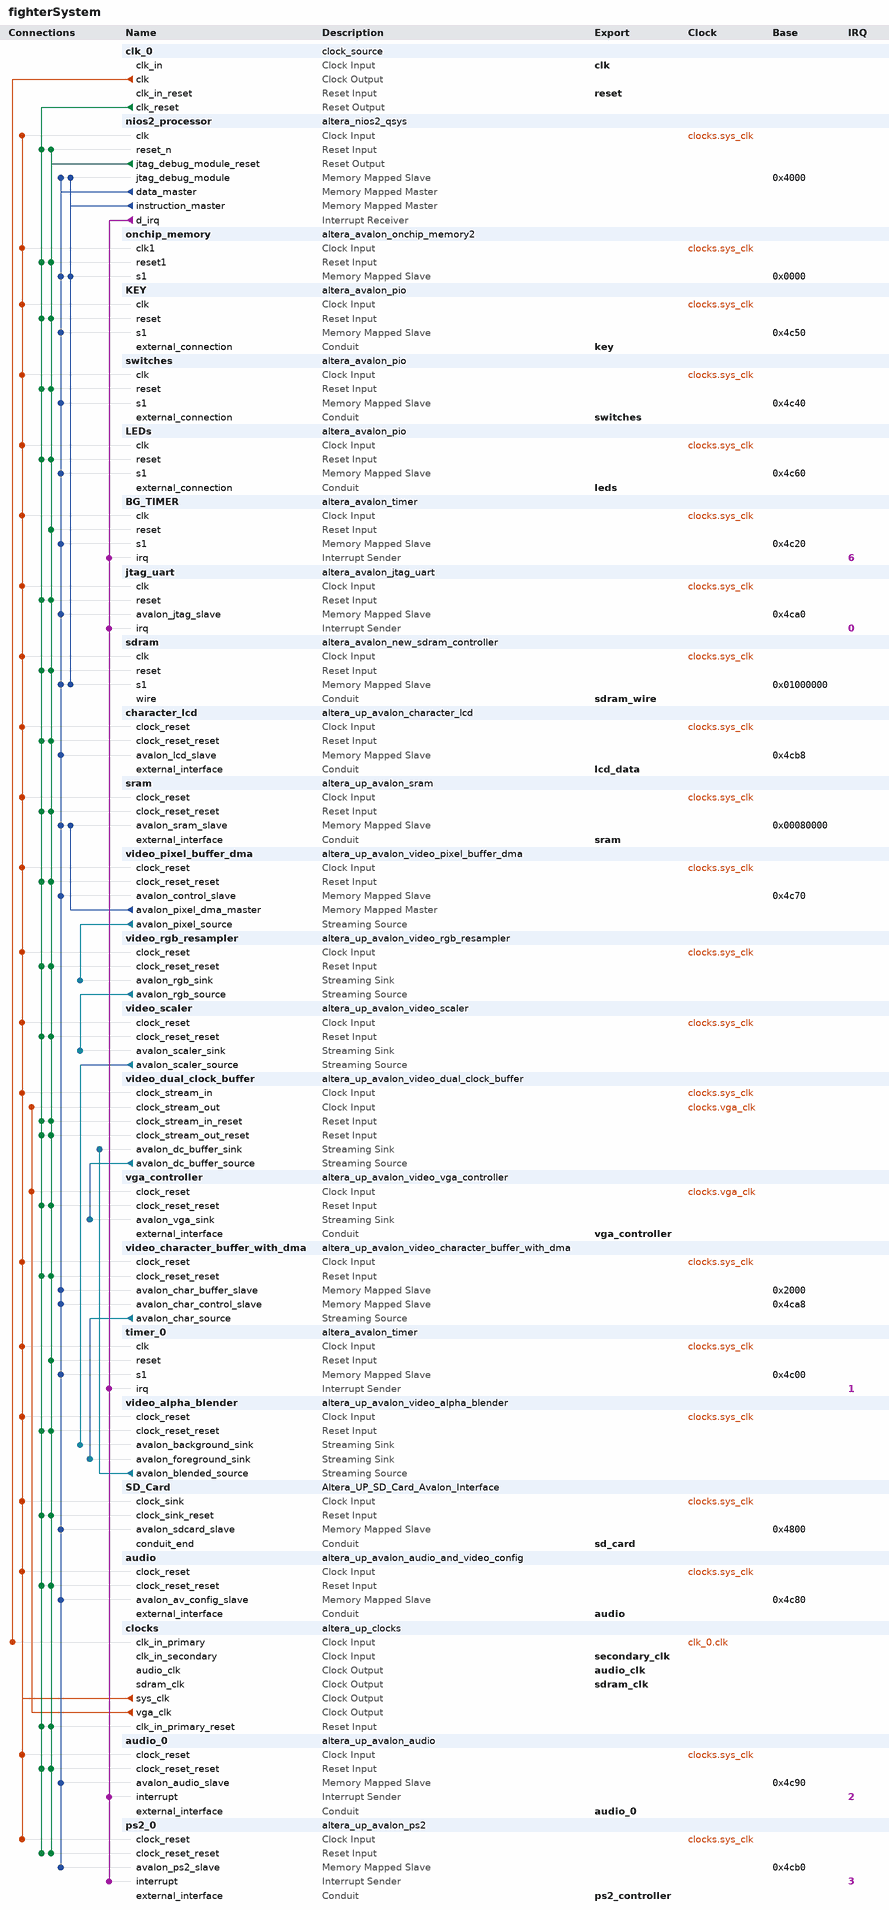
[diagram p0: system contents]
# Platform Designer (Qsys) system fighterSystem, Cyclone II EP2C35F672C6
# Parameters at their usual value, and those the tool derives, are not listed.
package require -exact qsys 12.0
create_system fighterSystem
set_project_property DEVICE_FAMILY {Cyclone II}
set_project_property DEVICE EP2C35F672C6

add_instance clk_0 clock_source 12.0
set_instance_parameter_value clk_0 clockFrequency 50000000

add_instance nios2_processor altera_nios2_qsys 12.0
set_instance_parameter_value nios2_processor resetSlave sdram.s1
set_instance_parameter_value nios2_processor exceptionSlave sdram.s1
set_instance_parameter_value nios2_processor breakSlave nios2_processor.jtag_debug_module
set_instance_parameter_value nios2_processor muldiv_multiplierType NoneSmall
set_instance_parameter_value nios2_processor impl Fast
set_instance_parameter_value nios2_processor icache_size 4096

add_instance onchip_memory altera_avalon_onchip_memory2 12.0
set_instance_parameter_value onchip_memory dataWidth 32
set_instance_parameter_value onchip_memory dualPort false
set_instance_parameter_value onchip_memory initMemContent true
set_instance_parameter_value onchip_memory initializationFileName onchip_memory
set_instance_parameter_value onchip_memory memorySize 4096

add_instance KEY altera_avalon_pio 12.0
set_instance_parameter_value KEY direction Input
set_instance_parameter_value KEY width 4

add_instance switches altera_avalon_pio 12.0
set_instance_parameter_value switches direction Input
set_instance_parameter_value switches width 8

add_instance LEDs altera_avalon_pio 12.0
set_instance_parameter_value LEDs direction Output
set_instance_parameter_value LEDs width 8

add_instance BG_TIMER altera_avalon_timer 12.0
set_instance_parameter_value BG_TIMER period 1
set_instance_parameter_value BG_TIMER periodUnits MSEC
set_instance_parameter_value BG_TIMER timerPreset CUSTOM

add_instance jtag_uart altera_avalon_jtag_uart 12.0
set_instance_parameter_value jtag_uart simInteractiveOptions INTERACTIVE_ASCII_OUTPUT

add_instance sdram altera_avalon_new_sdram_controller 12.0
set_instance_parameter_value sdram TAC 5.5
set_instance_parameter_value sdram TRCD 20.0
set_instance_parameter_value sdram TRP 20.0
set_instance_parameter_value sdram casLatency 3
set_instance_parameter_value sdram columnWidth 8
set_instance_parameter_value sdram dataWidth 16
set_instance_parameter_value sdram generateSimulationModel false
set_instance_parameter_value sdram model custom
set_instance_parameter_value sdram numberOfBanks 4
set_instance_parameter_value sdram numberOfChipSelects 1
set_instance_parameter_value sdram powerUpDelay 100.0
set_instance_parameter_value sdram refreshPeriod 15.625
set_instance_parameter_value sdram rowWidth 12

add_instance character_lcd altera_up_avalon_character_lcd 12.0
set_instance_parameter_value character_lcd cursor Normal

add_instance sram altera_up_avalon_sram 12.0
set_instance_parameter_value sram board DE2
set_instance_parameter_value sram pixel_buffer true

add_instance video_pixel_buffer_dma altera_up_avalon_video_pixel_buffer_dma 12.0
set_instance_parameter_value video_pixel_buffer_dma addr_mode Consecutive
set_instance_parameter_value video_pixel_buffer_dma start_address 0
set_instance_parameter_value video_pixel_buffer_dma back_start_address 0
set_instance_parameter_value video_pixel_buffer_dma image_width 320
set_instance_parameter_value video_pixel_buffer_dma image_height 240
set_instance_parameter_value video_pixel_buffer_dma color_space {16-bit RGB}

add_instance video_rgb_resampler altera_up_avalon_video_rgb_resampler 12.0
set_instance_parameter_value video_rgb_resampler input_type {16-bit RGB}
set_instance_parameter_value video_rgb_resampler output_type {30-bit RGB}
set_instance_parameter_value video_rgb_resampler alpha 1023

add_instance video_scaler altera_up_avalon_video_scaler 12.0
set_instance_parameter_value video_scaler width_scaling 2
set_instance_parameter_value video_scaler height_scaling 2
set_instance_parameter_value video_scaler width_in 320
set_instance_parameter_value video_scaler color_bits 10
set_instance_parameter_value video_scaler color_planes 3

add_instance video_dual_clock_buffer altera_up_avalon_video_dual_clock_buffer 12.0
set_instance_parameter_value video_dual_clock_buffer color_bits 10

add_instance vga_controller altera_up_avalon_video_vga_controller 12.0
set_instance_parameter_value vga_controller board DE2

add_instance video_character_buffer_with_dma altera_up_avalon_video_character_buffer_with_dma 12.0
set_instance_parameter_value video_character_buffer_with_dma enable_transparency true

add_instance timer_0 altera_avalon_timer 12.0
set_instance_parameter_value timer_0 period 1
set_instance_parameter_value timer_0 periodUnits MSEC
set_instance_parameter_value timer_0 timerPreset FULL_FEATURED

add_instance video_alpha_blender altera_up_avalon_video_alpha_blender 12.0

add_instance SD_Card Altera_UP_SD_Card_Avalon_Interface 1.0

add_instance audio altera_up_avalon_audio_and_video_config 12.0
set_instance_parameter_value audio board DE2
set_instance_parameter_value audio audio_in {Microphone to ADC}
set_instance_parameter_value audio line_in_bypass false
set_instance_parameter_value audio bit_length 16
set_instance_parameter_value audio sampling_rate {32 kHz}

add_instance clocks altera_up_clocks 12.0
set_instance_parameter_value clocks board DE2
set_instance_parameter_value clocks vga_clk true
set_instance_parameter_value clocks audio_clk true
set_instance_parameter_value clocks audio_clk_freq 12.288

add_instance audio_0 altera_up_avalon_audio 12.0
set_instance_parameter_value audio_0 avalon_bus_type {Memory Mapped}
set_instance_parameter_value audio_0 audio_in true
set_instance_parameter_value audio_0 dw 16

add_instance ps2_0 altera_up_avalon_ps2 12.0

# connections
add_connection clk_0.clk clocks.clk_in_primary clock
add_connection clocks.sys_clk audio.clock_reset clock
add_connection clocks.sys_clk audio_0.clock_reset clock
add_connection clocks.sys_clk BG_TIMER.clk clock
add_connection clocks.sys_clk character_lcd.clock_reset clock
add_connection clocks.sys_clk jtag_uart.clk clock
add_connection clocks.sys_clk KEY.clk clock
add_connection clocks.sys_clk LEDs.clk clock
add_connection clocks.sys_clk nios2_processor.clk clock
add_connection clocks.sys_clk onchip_memory.clk1 clock
add_connection clocks.sys_clk ps2_0.clock_reset clock
add_connection clocks.sys_clk SD_Card.clock_sink clock
add_connection clocks.sys_clk sdram.clk clock
add_connection clocks.sys_clk sram.clock_reset clock
add_connection clocks.sys_clk switches.clk clock
add_connection clocks.sys_clk timer_0.clk clock
add_connection clocks.sys_clk video_alpha_blender.clock_reset clock
add_connection clocks.sys_clk video_character_buffer_with_dma.clock_reset clock
add_connection clocks.sys_clk video_dual_clock_buffer.clock_stream_in clock
add_connection clocks.sys_clk video_pixel_buffer_dma.clock_reset clock
add_connection clocks.sys_clk video_rgb_resampler.clock_reset clock
add_connection clocks.sys_clk video_scaler.clock_reset clock
add_connection clocks.vga_clk vga_controller.clock_reset clock
add_connection clocks.vga_clk video_dual_clock_buffer.clock_stream_out clock
add_connection clk_0.clk_reset audio.clock_reset_reset reset
add_connection clk_0.clk_reset audio_0.clock_reset_reset reset
add_connection clk_0.clk_reset character_lcd.clock_reset_reset reset
add_connection clk_0.clk_reset clocks.clk_in_primary_reset reset
add_connection clk_0.clk_reset jtag_uart.reset reset
add_connection clk_0.clk_reset KEY.reset reset
add_connection clk_0.clk_reset LEDs.reset reset
add_connection clk_0.clk_reset nios2_processor.reset_n reset
add_connection clk_0.clk_reset onchip_memory.reset1 reset
add_connection clk_0.clk_reset ps2_0.clock_reset_reset reset
add_connection clk_0.clk_reset SD_Card.clock_sink_reset reset
add_connection clk_0.clk_reset sdram.reset reset
add_connection clk_0.clk_reset sram.clock_reset_reset reset
add_connection clk_0.clk_reset switches.reset reset
add_connection clk_0.clk_reset vga_controller.clock_reset_reset reset
add_connection clk_0.clk_reset video_alpha_blender.clock_reset_reset reset
add_connection clk_0.clk_reset video_character_buffer_with_dma.clock_reset_reset reset
add_connection clk_0.clk_reset video_dual_clock_buffer.clock_stream_in_reset reset
add_connection clk_0.clk_reset video_dual_clock_buffer.clock_stream_out_reset reset
add_connection clk_0.clk_reset video_pixel_buffer_dma.clock_reset_reset reset
add_connection clk_0.clk_reset video_rgb_resampler.clock_reset_reset reset
add_connection clk_0.clk_reset video_scaler.clock_reset_reset reset
add_connection nios2_processor.jtag_debug_module_reset audio.clock_reset_reset reset
add_connection nios2_processor.jtag_debug_module_reset audio_0.clock_reset_reset reset
add_connection nios2_processor.jtag_debug_module_reset BG_TIMER.reset reset
add_connection nios2_processor.jtag_debug_module_reset character_lcd.clock_reset_reset reset
add_connection nios2_processor.jtag_debug_module_reset clocks.clk_in_primary_reset reset
add_connection nios2_processor.jtag_debug_module_reset jtag_uart.reset reset
add_connection nios2_processor.jtag_debug_module_reset KEY.reset reset
add_connection nios2_processor.jtag_debug_module_reset LEDs.reset reset
add_connection nios2_processor.jtag_debug_module_reset nios2_processor.reset_n reset
add_connection nios2_processor.jtag_debug_module_reset onchip_memory.reset1 reset
add_connection nios2_processor.jtag_debug_module_reset ps2_0.clock_reset_reset reset
add_connection nios2_processor.jtag_debug_module_reset SD_Card.clock_sink_reset reset
add_connection nios2_processor.jtag_debug_module_reset sdram.reset reset
add_connection nios2_processor.jtag_debug_module_reset sram.clock_reset_reset reset
add_connection nios2_processor.jtag_debug_module_reset switches.reset reset
add_connection nios2_processor.jtag_debug_module_reset timer_0.reset reset
add_connection nios2_processor.jtag_debug_module_reset vga_controller.clock_reset_reset reset
add_connection nios2_processor.jtag_debug_module_reset video_alpha_blender.clock_reset_reset reset
add_connection nios2_processor.jtag_debug_module_reset video_character_buffer_with_dma.clock_reset_reset reset
add_connection nios2_processor.jtag_debug_module_reset video_dual_clock_buffer.clock_stream_in_reset reset
add_connection nios2_processor.jtag_debug_module_reset video_dual_clock_buffer.clock_stream_out_reset reset
add_connection nios2_processor.jtag_debug_module_reset video_pixel_buffer_dma.clock_reset_reset reset
add_connection nios2_processor.jtag_debug_module_reset video_rgb_resampler.clock_reset_reset reset
add_connection nios2_processor.jtag_debug_module_reset video_scaler.clock_reset_reset reset
add_connection nios2_processor.data_master audio.avalon_av_config_slave avalon
set_connection_parameter_value nios2_processor.data_master/audio.avalon_av_config_slave baseAddress 0x4c80
add_connection nios2_processor.data_master audio_0.avalon_audio_slave avalon
set_connection_parameter_value nios2_processor.data_master/audio_0.avalon_audio_slave baseAddress 0x4c90
add_connection nios2_processor.data_master BG_TIMER.s1 avalon
set_connection_parameter_value nios2_processor.data_master/BG_TIMER.s1 baseAddress 0x4c20
add_connection nios2_processor.data_master character_lcd.avalon_lcd_slave avalon
set_connection_parameter_value nios2_processor.data_master/character_lcd.avalon_lcd_slave baseAddress 0x4cb8
add_connection nios2_processor.data_master jtag_uart.avalon_jtag_slave avalon
set_connection_parameter_value nios2_processor.data_master/jtag_uart.avalon_jtag_slave baseAddress 0x4ca0
add_connection nios2_processor.data_master KEY.s1 avalon
set_connection_parameter_value nios2_processor.data_master/KEY.s1 baseAddress 0x4c50
add_connection nios2_processor.data_master LEDs.s1 avalon
set_connection_parameter_value nios2_processor.data_master/LEDs.s1 baseAddress 0x4c60
add_connection nios2_processor.data_master nios2_processor.jtag_debug_module avalon
set_connection_parameter_value nios2_processor.data_master/nios2_processor.jtag_debug_module baseAddress 0x4000
add_connection nios2_processor.data_master onchip_memory.s1 avalon
set_connection_parameter_value nios2_processor.data_master/onchip_memory.s1 baseAddress 0x0000
add_connection nios2_processor.data_master ps2_0.avalon_ps2_slave avalon
set_connection_parameter_value nios2_processor.data_master/ps2_0.avalon_ps2_slave baseAddress 0x4cb0
add_connection nios2_processor.data_master SD_Card.avalon_sdcard_slave avalon
set_connection_parameter_value nios2_processor.data_master/SD_Card.avalon_sdcard_slave baseAddress 0x4800
add_connection nios2_processor.data_master sdram.s1 avalon
set_connection_parameter_value nios2_processor.data_master/sdram.s1 baseAddress 0x01000000
add_connection nios2_processor.data_master sram.avalon_sram_slave avalon
set_connection_parameter_value nios2_processor.data_master/sram.avalon_sram_slave baseAddress 0x00080000
add_connection nios2_processor.data_master switches.s1 avalon
set_connection_parameter_value nios2_processor.data_master/switches.s1 baseAddress 0x4c40
add_connection nios2_processor.data_master timer_0.s1 avalon
set_connection_parameter_value nios2_processor.data_master/timer_0.s1 baseAddress 0x4c00
add_connection nios2_processor.data_master video_character_buffer_with_dma.avalon_char_buffer_slave avalon
set_connection_parameter_value nios2_processor.data_master/video_character_buffer_with_dma.avalon_char_buffer_slave baseAddress 0x2000
add_connection nios2_processor.data_master video_character_buffer_with_dma.avalon_char_control_slave avalon
set_connection_parameter_value nios2_processor.data_master/video_character_buffer_with_dma.avalon_char_control_slave baseAddress 0x4ca8
add_connection nios2_processor.data_master video_pixel_buffer_dma.avalon_control_slave avalon
set_connection_parameter_value nios2_processor.data_master/video_pixel_buffer_dma.avalon_control_slave baseAddress 0x4c70
add_connection nios2_processor.instruction_master nios2_processor.jtag_debug_module avalon
set_connection_parameter_value nios2_processor.instruction_master/nios2_processor.jtag_debug_module baseAddress 0x4000
add_connection nios2_processor.instruction_master nios2_processor.jtag_debug_module avalon
set_connection_parameter_value nios2_processor.instruction_master/nios2_processor.jtag_debug_module baseAddress 0x4000
add_connection nios2_processor.instruction_master onchip_memory.s1 avalon
set_connection_parameter_value nios2_processor.instruction_master/onchip_memory.s1 baseAddress 0x0000
add_connection nios2_processor.instruction_master sdram.s1 avalon
set_connection_parameter_value nios2_processor.instruction_master/sdram.s1 baseAddress 0x01000000
add_connection video_pixel_buffer_dma.avalon_pixel_dma_master sram.avalon_sram_slave avalon
set_connection_parameter_value video_pixel_buffer_dma.avalon_pixel_dma_master/sram.avalon_sram_slave baseAddress 0x00080000
add_connection video_alpha_blender.avalon_blended_source video_dual_clock_buffer.avalon_dc_buffer_sink avalon_streaming
add_connection video_character_buffer_with_dma.avalon_char_source video_alpha_blender.avalon_foreground_sink avalon_streaming
add_connection video_dual_clock_buffer.avalon_dc_buffer_source vga_controller.avalon_vga_sink avalon_streaming
add_connection video_pixel_buffer_dma.avalon_pixel_source video_rgb_resampler.avalon_rgb_sink avalon_streaming
add_connection video_rgb_resampler.avalon_rgb_source video_scaler.avalon_scaler_sink avalon_streaming
add_connection video_scaler.avalon_scaler_source video_alpha_blender.avalon_background_sink avalon_streaming
add_connection nios2_processor.d_irq audio_0.interrupt interrupt
set_connection_parameter_value nios2_processor.d_irq/audio_0.interrupt irqNumber 2
add_connection nios2_processor.d_irq BG_TIMER.irq interrupt
set_connection_parameter_value nios2_processor.d_irq/BG_TIMER.irq irqNumber 6
add_connection nios2_processor.d_irq jtag_uart.irq interrupt
set_connection_parameter_value nios2_processor.d_irq/jtag_uart.irq irqNumber 0
add_connection nios2_processor.d_irq ps2_0.interrupt interrupt
set_connection_parameter_value nios2_processor.d_irq/ps2_0.interrupt irqNumber 3
add_connection nios2_processor.d_irq timer_0.irq interrupt
set_connection_parameter_value nios2_processor.d_irq/timer_0.irq irqNumber 1

# exported interfaces
add_interface clk clock sink
set_interface_property clk EXPORT_OF clk_0.clk_in
add_interface reset reset sink
set_interface_property reset EXPORT_OF clk_0.clk_in_reset
add_interface switches conduit end
set_interface_property switches EXPORT_OF switches.external_connection
add_interface leds conduit end
set_interface_property leds EXPORT_OF LEDs.external_connection
add_interface sdram_wire conduit end
set_interface_property sdram_wire EXPORT_OF sdram.wire
add_interface sdram_clk clock source
set_interface_property sdram_clk EXPORT_OF clocks.sdram_clk
add_interface lcd_data conduit end
set_interface_property lcd_data EXPORT_OF character_lcd.external_interface
add_interface sram conduit end
set_interface_property sram EXPORT_OF sram.external_interface
add_interface vga_controller conduit end
set_interface_property vga_controller EXPORT_OF vga_controller.external_interface
add_interface key conduit end
set_interface_property key EXPORT_OF KEY.external_connection
add_interface sd_card conduit end
set_interface_property sd_card EXPORT_OF SD_Card.conduit_end
add_interface audio conduit end
set_interface_property audio EXPORT_OF audio.external_interface
add_interface audio_0 conduit end
set_interface_property audio_0 EXPORT_OF audio_0.external_interface
add_interface audio_clk clock source
set_interface_property audio_clk EXPORT_OF clocks.audio_clk
add_interface secondary_clk clock sink
set_interface_property secondary_clk EXPORT_OF clocks.clk_in_secondary
add_interface ps2_controller conduit end
set_interface_property ps2_controller EXPORT_OF ps2_0.external_interface

save_system fighterSystem.qsys
